# Altium schematic sheet 03b_StepperMotorDriver.SchDoc: Stepper Motor Driver
size A3; SheetNumber: 5; SheetTotal: 10
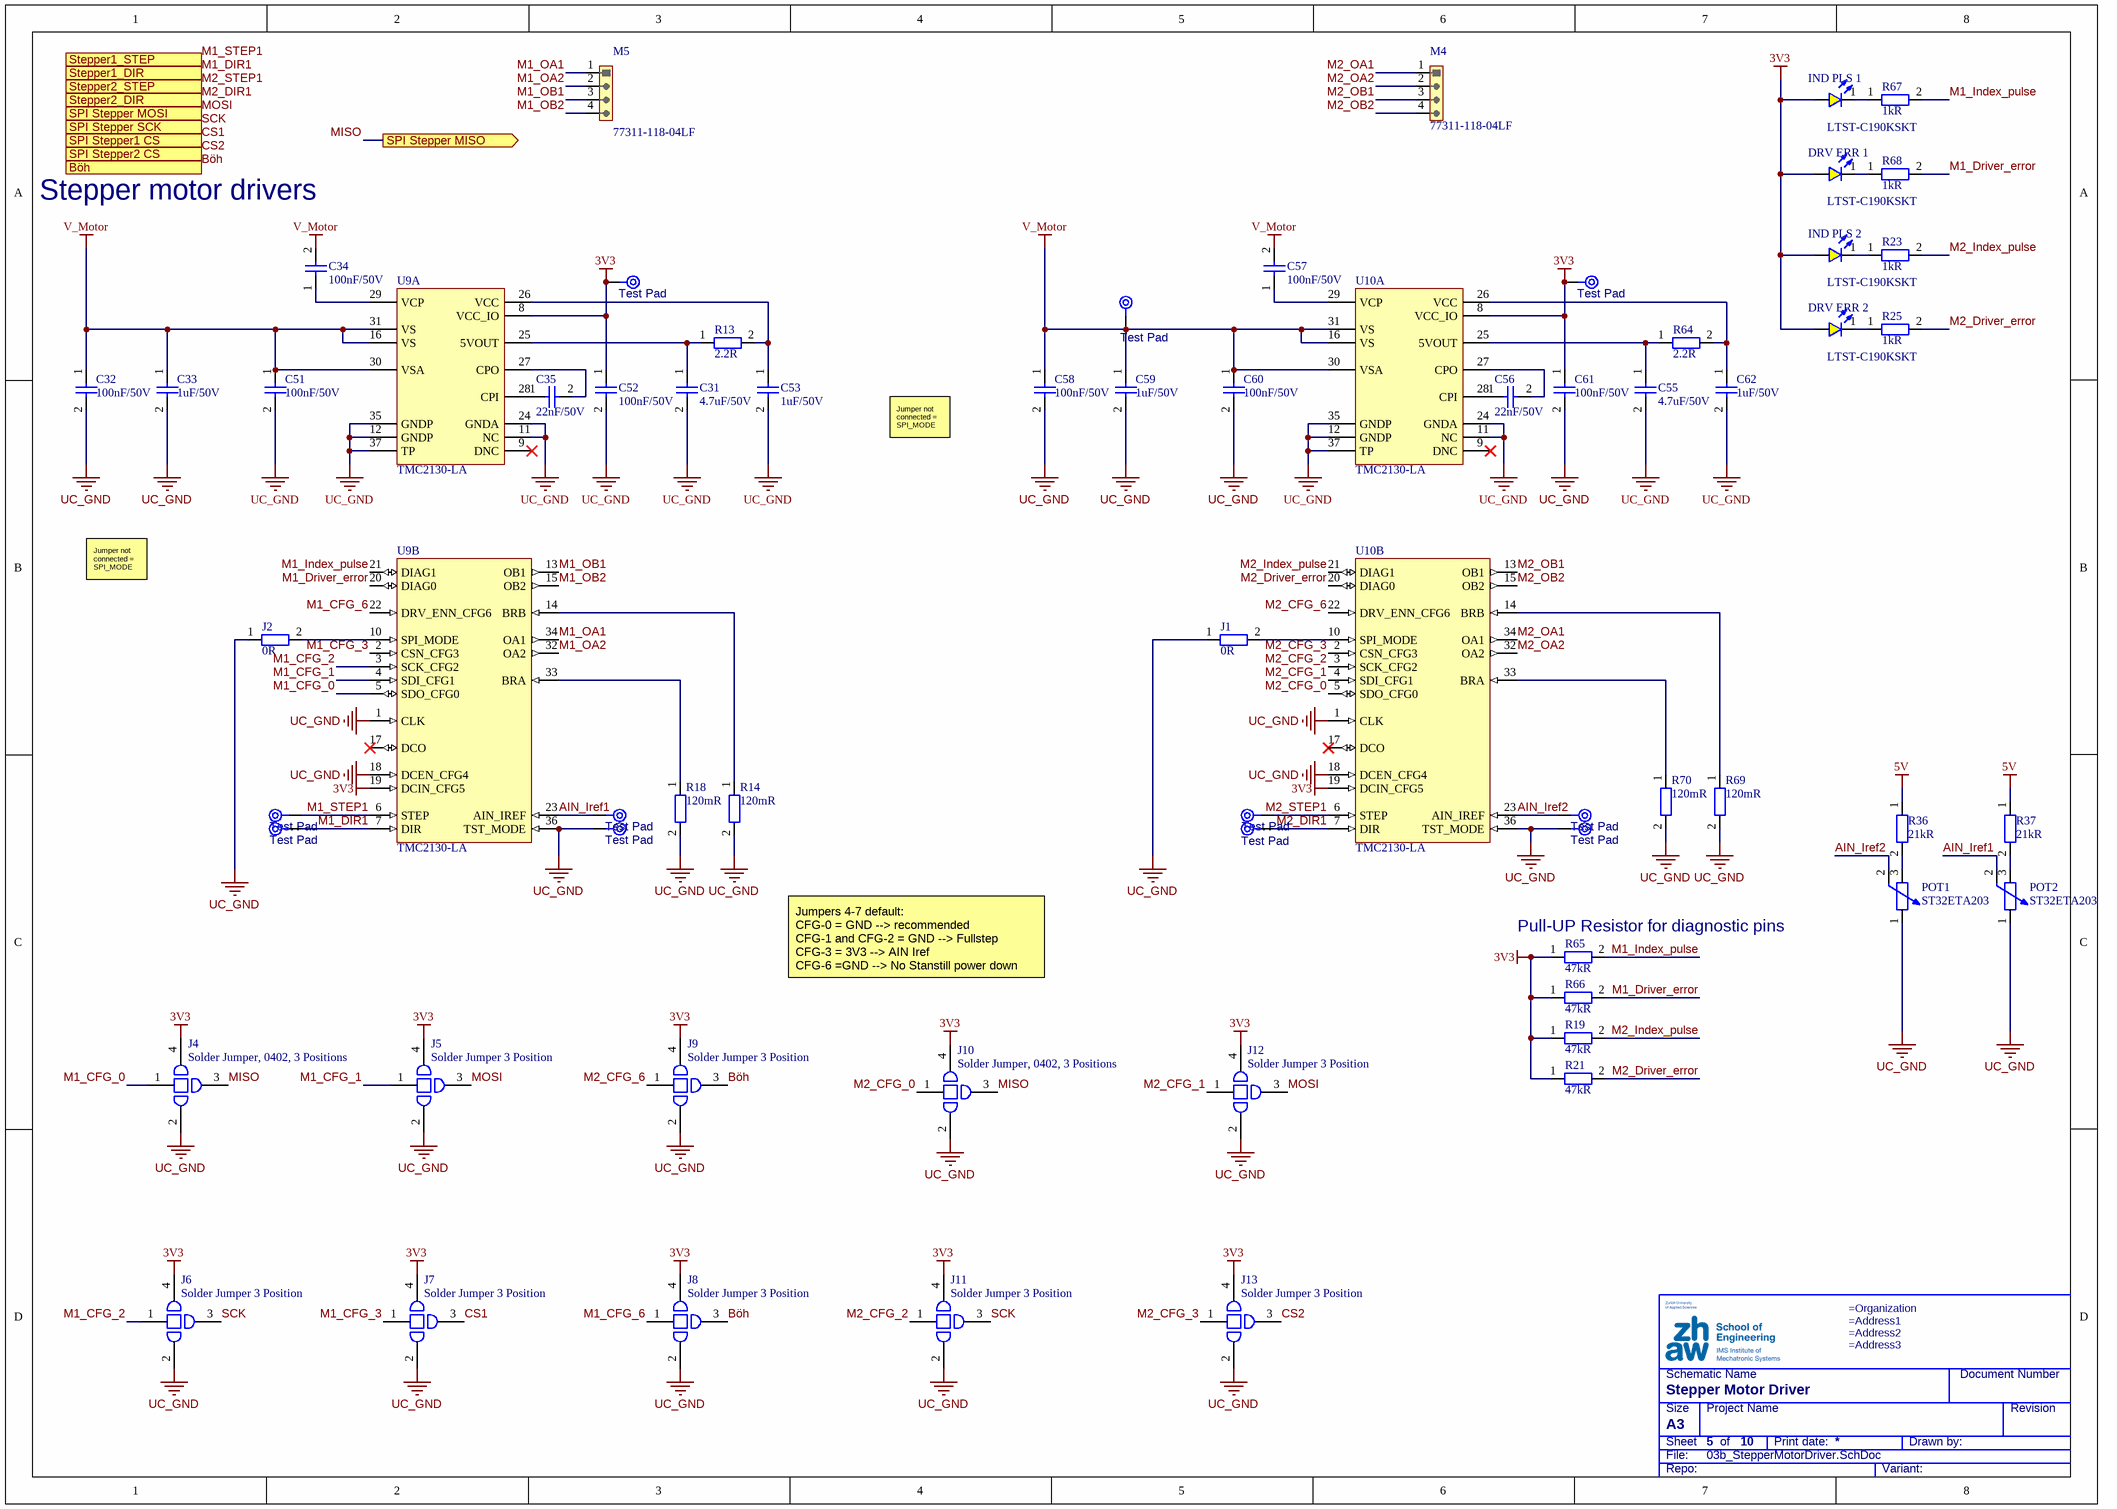
[diagram p0: 03b_StepperMotorDriver.SchDoc]

## Parts
6_M1_STEP  Test Pad  [TP10R]  (no BOM)
6_STEP_2  Test Pad  [TP10R]  (no BOM)
7_DIR_2  Test Pad  [TP10R]  (no BOM)
7_M1_DIR  Test Pad  [TP10R]  (no BOM)
8_VCC_IO  Test Pad  [TP10R]  (no BOM)
8_VCC_IO_2  Test Pad  [TP10R]  (no BOM)
16_31_VS_2  Test Pad  [TP10R]  (no BOM)
23_AIN_IREF  Test Pad  [TP10R]  (no BOM)
23_AIN_IREF_2  Test Pad  [TP10R]  (no BOM)
36_TST_MODE  Test Pad  [TP10R]  (no BOM)
36_TST_MODE_2  Test Pad  [TP10R]  (no BOM)
C31  4.7uF/50V  [CAPC2012X15L]
C32  100nF/50V  [CAPC1005X05L]
C33  1uF/50V  [CAPC1608X09L]
C34  100nF/50V  [CAPC1005X05L]
C35  22nF/50V  [CAPC1005X05L]
C51  100nF/50V  [CAPC1005X05L]
C52  100nF/50V  [CAPC1005X05L]
C53  1uF/50V  [CAPC1608X09L]
C55  4.7uF/50V  [CAPC2012X15L]
C56  22nF/50V  [CAPC1005X05L]
C57  100nF/50V  [CAPC1005X05L]
C58  100nF/50V  [CAPC1005X05L]
C59  1uF/50V  [CAPC1608X09L]
C60  100nF/50V  [CAPC1005X05L]
C61  100nF/50V  [CAPC1005X05L]
C62  1uF/50V  [CAPC1608X09L]
DRV_ERR_1  LTST-C190KSKT  [LEDSC160X80X80-2Lye]
DRV_ERR_2  LTST-C190KSKT  [LEDSC160X80X80-2Lye]
IND_PLS_1  LTST-C190KSKT  [LEDSC160X80X80-2Lye]
IND_PLS_2  LTST-C190KSKT  [LEDSC160X80X80-2Lye]
J1  0R  [RESC1005X04L]
J2  0R  [RESC1005X04L]
J4  Solder Jumper, 0402, 3 Positions  [Solder Jumper 3 Positions, Position 1]
J5  Solder Jumper 3 Position  [Solder Jumper, 0402, 3 Positions, DNP]
J6  Solder Jumper 3 Position  [Solder Jumper, 0402, 3 Positions, DNP]
J7  Solder Jumper 3 Position  [Solder Jumper, 0402, 3 Positions, DNP]
J8  Solder Jumper 3 Position  [Solder Jumper 3 Positions, Position 2]
J9  Solder Jumper 3 Position  [Solder Jumper 3 Positions, Position 2]
J10  Solder Jumper, 0402, 3 Positions  [Solder Jumper 3 Positions, Position 1]
J11  Solder Jumper 3 Position  [Solder Jumper, 0402, 3 Positions, DNP]
J12  Solder Jumper 3 Position  [Solder Jumper, 0402, 3 Positions, DNP]
J13  Solder Jumper 3 Position  [Solder Jumper, 0402, 3 Positions, DNP]
M4  77311-118-04LF  [HD254_1X4_MV]
M5  77311-118-04LF  [HD254_1X4_MV]
POT1  ST32ETA203  [ST-32-Trimm]
POT2  ST32ETA203  [ST-32-Trimm]
R13  2.2R  [RESC1005X04L]
R14  120mR  [RESC1632X06]
R18  120mR  [RESC1632X06]
R19  47kR  [RESC1005X04L]
R21  47kR  [RESC1005X04L]
R23  1kR  [RESC1005X04L]
R25  1kR  [RESC1005X04L]
R36  21kR  [RESC1005X04L]
R37  21kR  [RESC1005X04L]
R64  2.2R  [RESC1005X04L]
R65  47kR  [RESC1005X04L]
R66  47kR  [RESC1005X04L]
R67  1kR  [RESC1005X04L]
R68  1kR  [RESC1005X04L]
R69  120mR  [RESC1632X06]
R70  120mR  [RESC1632X06]
U9  TMC2130-LA  [QFN50P500X600X80-37T360X410L]  (parts A,B of 2)
U10  TMC2130-LA  [QFN50P500X600X80-37T360X410L]  (parts A,B of 2)

## Ports
Böh (in), SPI Stepper1 CS (in), SPI Stepper2 CS (in), SPI Stepper MISO (out), SPI Stepper MOSI (in), SPI Stepper SCK (in), Stepper1_DIR, Stepper1_STEP, Stepper2_DIR, Stepper2_STEP

## Nets
3V3: 8_VCC_IO.1(TP) 8_VCC_IO_2.1(TP) C52.1 C61.1 DRV_ERR_1.2(A) DRV_ERR_2.2(A) IND_PLS_1.2(A) IND_PLS_2.2(A) J4.4 J5.4 J6.4 J7.4 J8.4 J9.4 J10.4 J11.4 J12.4 J13.4 R19.1 R21.1 R65.1 R66.1 U9.8(VCC_IO) U9.19(DCIN_CFG5) U10.8(VCC_IO) U10.19(DCIN_CFG5)
5V: R36.1 R37.1
UC_GND: 36_TST_MODE.1(TP) 36_TST_MODE_2.1(TP) C31.2 C32.2 C33.2 C51.2 C52.2 C53.2 C55.2 C58.2 C59.2 C60.2 C61.2 C62.2 J1.1 J2.1 J4.2 J5.2 J6.2 J7.2 J8.2 J9.2 J10.2 J11.2 J12.2 J13.2 POT1.1(CCW) POT2.1(CCW) R14.2 R18.2 R69.2 R70.2 U9.1(CLK) U9.11(NC) U9.12(GNDP) U9.18(DCEN_CFG4) U9.24(GNDA) U9.35(GNDP) U9.36(TST_MODE) U9.37(TP) U10.1(CLK) U10.11(NC) U10.12(GNDP) U10.18(DCEN_CFG4) U10.24(GNDA) U10.35(GNDP) U10.36(TST_MODE) U10.37(TP)
V_Motor: 16_31_VS_2.1(TP) C32.1 C33.1 C34.2 C51.1 C57.2 C58.1 C59.1 C60.1 U9.16(VS) U9.30(VSA) U9.31(VS) U10.16(VS) U10.30(VSA) U10.31(VS)
AIN_Iref1: 23_AIN_IREF.1(TP) POT2.2(S) U9.23(AIN_IREF)
AIN_Iref2: 23_AIN_IREF_2.1(TP) POT1.2(S) U10.23(AIN_IREF)
Böh: J8.3 J9.3 ; port Böh
CS1: J7.3 ; port SPI Stepper1 CS
CS2: J13.3 ; port SPI Stepper2 CS
M1_CFG_0: J4.1 U9.5(SDO_CFG0)
M1_CFG_1: J5.1 U9.4(SDI_CFG1)
M1_CFG_2: J6.1 U9.3(SCK_CFG2)
M1_CFG_3: J7.1 U9.2(CSN_CFG3)
M1_CFG_6: J8.1 U9.22(DRV_ENN_CFG6)
M1_DIR1: 7_M1_DIR.1(TP) U9.7(DIR) ; port Stepper1_DIR
M1_Driver_error: R66.2 R68.2 U9.20(DIAG0)
M1_Index_pulse: R65.2 R67.2 U9.21(DIAG1)
M1_OA1: M5.1 U9.34(OA1)
M1_OA2: M5.2 U9.32(OA2)
M1_OB1: M5.3 U9.13(OB1)
M1_OB2: M5.4 U9.15(OB2)
M1_STEP1: 6_M1_STEP.1(TP) U9.6(STEP) ; port Stepper1_STEP
M2_CFG_0: J10.1 U10.5(SDO_CFG0)
M2_CFG_1: J12.1 U10.4(SDI_CFG1)
M2_CFG_2: J11.1 U10.3(SCK_CFG2)
M2_CFG_3: J13.1 U10.2(CSN_CFG3)
M2_CFG_6: J9.1 U10.22(DRV_ENN_CFG6)
M2_DIR1: 7_DIR_2.1(TP) U10.7(DIR) ; port Stepper2_DIR
M2_Driver_error: R21.2 R25.2 U10.20(DIAG0)
M2_Index_pulse: R19.2 R23.2 U10.21(DIAG1)
M2_OA1: M4.1 U10.34(OA1)
M2_OA2: M4.2 U10.32(OA2)
M2_OB1: M4.3 U10.13(OB1)
M2_OB2: M4.4 U10.15(OB2)
M2_STEP1: 6_STEP_2.1(TP) U10.6(STEP) ; port Stepper2_STEP
MISO: J4.3 J10.3 ; port SPI Stepper MISO
MOSI: J5.3 J12.3 ; port SPI Stepper MOSI
SCK: J6.3 J11.3 ; port SPI Stepper SCK
NetC31_1: C31.1 R13.1 U9.25(5VOUT)
NetC34_1: C34.1 U9.29(VCP)
NetC35_1: C35.1 U9.28(CPI)
NetC35_2: C35.2 U9.27(CPO)
NetC53_1: C53.1 R13.2 U9.26(VCC)
NetC55_1: C55.1 R64.1 U10.25(5VOUT)
NetC56_1: C56.1 U10.28(CPI)
NetC56_2: C56.2 U10.27(CPO)
NetC57_1: C57.1 U10.29(VCP)
NetC62_1: C62.1 R64.2 U10.26(VCC)
NetDRV_ERR_1_1: DRV_ERR_1.1(K) R68.1
NetDRV_ERR_2_1: DRV_ERR_2.1(K) R25.1
NetIND_PLS_1_1: IND_PLS_1.1(K) R67.1
NetIND_PLS_2_1: IND_PLS_2.1(K) R23.1
NetJ1_2: J1.2 U10.10(SPI_MODE)
NetJ2_2: J2.2 U9.10(SPI_MODE)
NetPOT1_3: POT1.3(CW) R36.2
NetPOT2_3: POT2.3(CW) R37.2
NetR14_1: R14.1 U9.14(BRB)
NetR18_1: R18.1 U9.33(BRA)
NetR69_1: R69.1 U10.14(BRB)
NetR70_1: R70.1 U10.33(BRA)

Not connected (* = marked no-connect by the designer): U9 9(DNC)* 17(DCO)*; U10 9(DNC)* 17(DCO)*

## Notes on the sheet
- Stepper motor drivers
- Jumper not connected = SPI_MODE
- Jumpers 4-7 default:
  CFG-0 = GND --> recommended
  CFG-1 and CFG-2 = GND --> Fullstep
  CFG-3 = 3V3 --> AIN Iref
  CFG-6 =GND --> No Stanstill power down
- (near R65) Pull-UP Resistor for diagnostic pins
- Schematic Name
- Document Number
- File:
- Sheet
- Size
- A3
- Project Name
- of
- Print date:
- Drawn by:
- Revision
- Repo:
- Variant:

## Library data of the parts
6_M1_STEP 6_STEP_2 7_DIR_2 7_M1_DIR 8_VCC_IO 8_VCC_IO_2 16_31_VS_2 23_AIN_IREF 23_AIN_IREF_2 36_TST_MODE 36_TST_MODE_2 = CMP-00028-00011-11: Test Pad 1.0 mm, SMD, d1.0; Mounting Technology: SMD; Size: d1.0; Type: Test Pad
C31 C55 = CMP-00016-9: Cap MLCC, 4.7uF, 50V, X5R, 10%, 0805; Designator: C; Value: 4.7µF; Case/Package: 0805; Case Code (Metric): 2012; Dielectricum: X5R; Mounting Technology: SMD; Tolerance: 10%; Type: MLCC; Voltage Rating: 50V
C32 C34 C51 C52 C57 C58 C60 C61 = CMP-001-00067-18: Cap MLCC, 100nF, 50V, X7R, 10%, 0402; Designator: C; Value: 100nF; Case/Package: 0402; Case Code (Metric): 1005; Dielectricum: X7R; Mounting Technology: SMD; Tolerance: 10%; Type: MLCC; Voltage Rating: 50V
C33 C53 C59 C62 = CMP-00006-9: Cap MLCC, 1uF, 50V, X5R, 10%, 0603; Designator: C; Value: 1µF; Case/Package: 0603; Case Code (Metric): 1608; Dielectricum: X5R; Mounting Technology: SMD; Tolerance: 10%; Type: MLCC; Voltage Rating: 50V
C35 C56 = CMP-001-00062-18: Cap MLCC, 22nF, 50V, X7R, 10%, 0402; Type: MLCC; Case/Package: 0402; Case Code (Metric): 1005; Dielectricum: X7R; Mounting Technology: SMD; Tolerance: 10%; Value: 22nF; Voltage Rating: 50V
DRV_ERR_1 DRV_ERR_2 IND_PLS_1 IND_PLS_2 = CMP-007-00025-12: LED, Yellow, 20mA, 2.0V, 0603; Forward Voltage: 2V; Case/Package: 0603; Color: Yellow; Mounting Technology: SMD; Rated Current: 20mA; Size: L1.6B0.8H0.8
J1 J2 = CMP-009-00148-29: Res, 0R, 1%, 0.063W, 0402; Designator: R; Value: 0; Power: 63mW; Voltage Rating: 50V; Case/Package: 0402; Case Code (Metric): 1005; Mounting Technology: SMD; Tolerance: 1%; Type: Fixed
J4-J13 = CMP-00030-00013-3: Solder Jumper, 0402, 3 Positions, SMD; Mounting Technology: SMD; Type: Solder Jumper
M4 M5 = CMP-002-00114-13: Header, 1x4Pin, Pitch 2.54mm, Male, Vertical, THT; Manufacturer: FCI; Designator: CON; Mating Length: 5.84mm; Overall Contact Length: 11.43mm; Pin Mapping: 1x4; Angle: Vertical; Gender: Male; Insulation Height: 2.54mm; Mounting Technology: THT; Pins: 4; Pitch: 2.54mm; Pitch Row: 2.54mm; Termination Length: 3.05mm
POT1 POT2 = CMP-009-00192-14: Trim, 20kR, 10%, 0.125W, SMD; Power: 125mW; Tolerance: 20%; Value: 20k; Voltage Rating: 200V; Case/Package: SMD-3; Mounting Technology: SMD; Size: L3.4B3.4H2; Type: Trimmer
R13 R64 = CMP-009-00128-30: Res, 2.2R, 1%, 0.063W, 0402; Power: 63mW; Value: 2.2; Voltage Rating: 50V; Case/Package: 0402; Case Code (Metric): 1005; Mounting Technology: SMD; Tolerance: 1%; Type: Fixed
R14 R18 R69 R70 = CMP-009-00457-1: Res, 120mR, 1%, 1W, 0612; Temperature Coefficient: 100ppm; Value: 0.12; Voltage Rating: 200V; Case/Package: 0612; Case Code (Metric): 1632; Mounting Technology: SMD; Power: 1W; Tolerance: 1%; Type: Fixed
R19 R21 R65 R66 = CMP-009-00137-31: Res, 47kR, 1%, 0.063W, 0402; Designator: R; Value: 47k; Power: 63mW; Voltage Rating: 50V; Case/Package: 0402; Case Code (Metric): 1005; Mounting Technology: SMD; Tolerance: 1%; Type: Fixed
R23 R25 R67 R68 = CMP-009-00009-32: Res, 1kR, 1%, 0.1W, 0402; Value: 1k; Power: 100mW; Voltage Rating: 50V; Case/Package: 0402; Case Code (Metric): 1005; Mounting Technology: SMD; Tolerance: 1%; Type: Fixed
R36 R37 = CMP-009-00451-1: Res, 21kR, 1%, 0.063W, 0402; Designator: R; Value: 21k; Power: 63mW; Temperature Coefficient: 100ppm; Voltage Rating: 50V; Case/Package: 0402; Case Code (Metric): 1005; Mounting Technology: SMD; Tolerance: 1%; Type: Fixed
U9 = CMP-00364-3: Stepper Motor Driver, 1Ch, 3..5.5V, Power 4.75..46V, 2A, QFN-36; Max Power Voltage: 46V; Max Logic Voltage: 5.25V; Channels: 1; Min Power Voltage: 5.5V; Min Logic Voltage: 3V; Case/Package: QFN-36; Max Current: 2A; Function: Stepper Motor Driver; Mounting Technology: SMD
U10 = CMP-00364-3: Stepper Motor Driver, 1Ch, 3..5.5V, Power 4.75..46V, 2A, QFN-36; Max Power Voltage: 46V; Max Logic Voltage: 5.25V; Min Logic Voltage: 3V; Min Power Voltage: 5.5V; Channels: 1; Mounting Technology: SMD; Case/Package: QFN-36; Max Current: 2A; Function: Stepper Motor Driver